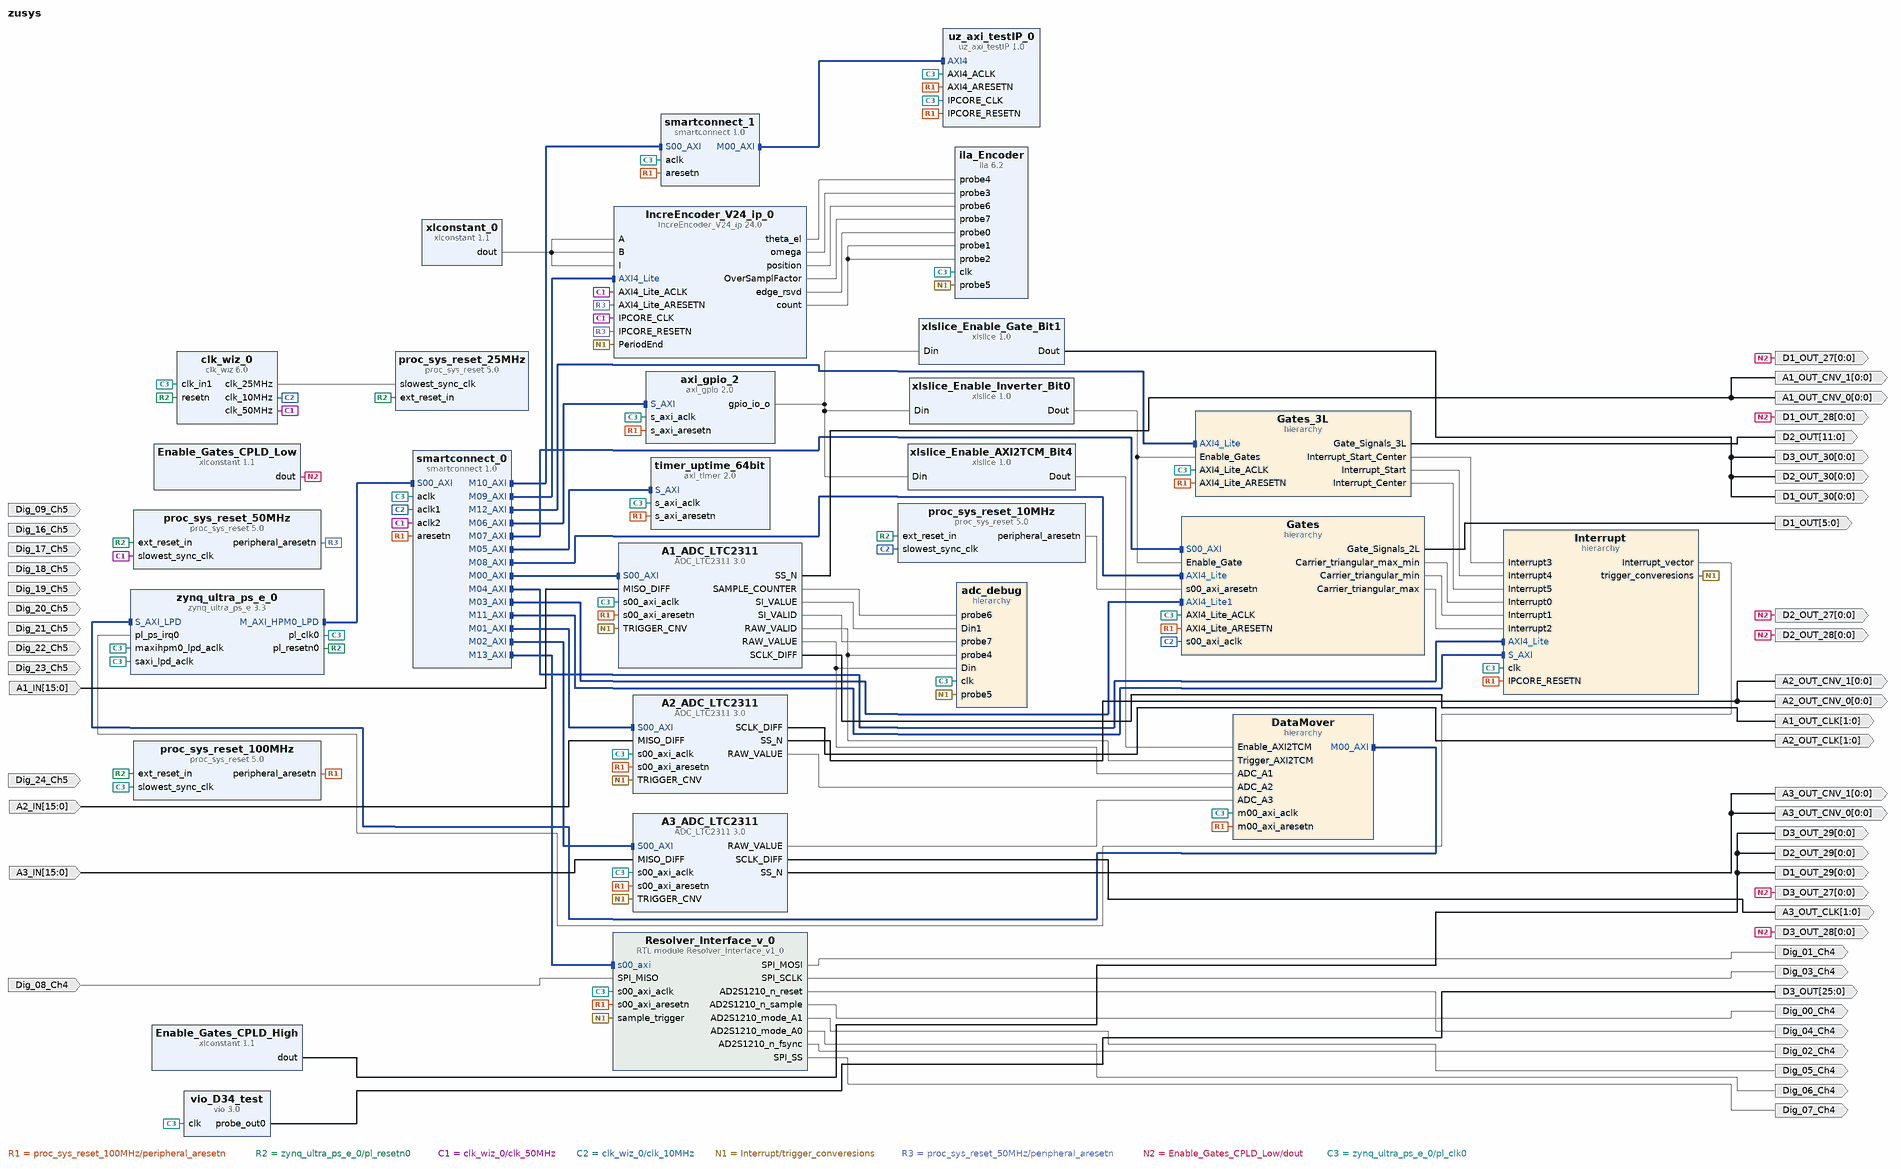
[diagram p0: block diagram of the top level]
# Vivado block design zusys, xczu9eg-ffvc900-1-e, Vivado 2020.1.1
create_bd_design zusys

create_bd_port -dir I Dig_16_Ch5
create_bd_port -dir I Dig_18_Ch5
create_bd_port -dir I Dig_20_Ch5
create_bd_port -dir I Dig_21_Ch5
create_bd_port -dir I Dig_22_Ch5
create_bd_port -dir I Dig_23_Ch5
create_bd_port -dir I Dig_24_Ch5
create_bd_port -dir I Dig_17_Ch5
create_bd_port -dir I Dig_19_Ch5
create_bd_port -dir O -from 0 -to 0 D1_OUT_29
create_bd_port -dir O -from 0 -to 0 D1_OUT_28
create_bd_port -dir O -from 0 -to 0 D1_OUT_27
create_bd_port -dir O -from 0 -to 0 D1_OUT_30
create_bd_port -dir O -from 0 -to 0 D2_OUT_28
create_bd_port -dir O -from 0 -to 0 D2_OUT_27
create_bd_port -dir O -from 0 -to 0 D2_OUT_29
create_bd_port -dir O -from 0 -to 0 D2_OUT_30
create_bd_port -dir O -from 11 -to 0 D2_OUT
create_bd_port -dir I -from 15 -to 0 A2_IN
create_bd_port -dir I -from 15 -to 0 A3_IN
create_bd_port -dir I -from 15 -to 0 A1_IN
create_bd_port -dir O -from 0 -to 0 D3_OUT_28
create_bd_port -dir O -from 0 -to 0 D3_OUT_29
create_bd_port -dir O -from 0 -to 0 D3_OUT_30
create_bd_port -dir O -from 25 -to 0 D3_OUT
create_bd_port -dir O -from 0 -to 0 D3_OUT_27
create_bd_port -dir O -from 5 -to 0 D1_OUT
create_bd_port -dir O -from 1 -to 0 A3_OUT_CLK
create_bd_port -dir O -from 1 -to 0 A2_OUT_CLK
create_bd_port -dir O -from 0 -to 0 A2_OUT_CNV_0
create_bd_port -dir O -from 0 -to 0 A2_OUT_CNV_1
create_bd_port -dir O -from 0 -to 0 A3_OUT_CNV_0
create_bd_port -dir O -from 0 -to 0 A3_OUT_CNV_1
create_bd_port -dir O -from 0 -to 0 A1_OUT_CNV_1
create_bd_port -dir O -from 0 -to 0 A1_OUT_CNV_0
create_bd_port -dir O -from 1 -to 0 A1_OUT_CLK
create_bd_port -dir I Dig_09_Ch5
create_bd_port -dir O Dig_00_Ch4
create_bd_port -dir O Dig_02_Ch4
create_bd_port -dir O Dig_03_Ch4
create_bd_port -dir O Dig_04_Ch4
create_bd_port -dir O Dig_05_Ch4
create_bd_port -dir O Dig_06_Ch4
create_bd_port -dir O Dig_07_Ch4
create_bd_port -dir O Dig_01_Ch4
create_bd_port -dir I Dig_08_Ch4

create_bd_cell -type ip -vlnv xilinx.com:ip:proc_sys_reset:5.0 proc_sys_reset_25MHz
create_bd_cell -type ip -vlnv xilinx.com:ip:proc_sys_reset:5.0 proc_sys_reset_10MHz
create_bd_cell -type ip -vlnv xilinx.com:ip:proc_sys_reset:5.0 proc_sys_reset_50MHz
create_bd_cell -type ip -vlnv xilinx.com:ip:proc_sys_reset:5.0 proc_sys_reset_100MHz
create_bd_cell -type ip -vlnv xilinx.com:ip:xlslice:1.0 xlslice_Enable_Inverter_Bit0
set_property -dict {CONFIG.DIN_FROM 0 CONFIG.DIN_TO 0 CONFIG.DIN_WIDTH 8} [get_bd_cells xlslice_Enable_Inverter_Bit0]
create_bd_cell -type ip -vlnv xilinx.com:ip:xlslice:1.0 xlslice_Enable_Gate_Bit1
set_property -dict [list \
  CONFIG.DIN_FROM 1 \
  CONFIG.DIN_TO 1 \
  CONFIG.DIN_WIDTH 8 \
  CONFIG.DOUT_WIDTH 1 \
] [get_bd_cells xlslice_Enable_Gate_Bit1]
create_bd_cell -type hier Gates
create_bd_cell -type hier DataMover
create_bd_cell -type ip -vlnv xilinx.com:ip:xlslice:1.0 xlslice_Enable_AXI2TCM_Bit4
set_property -dict [list \
  CONFIG.DIN_FROM 4 \
  CONFIG.DIN_TO 4 \
  CONFIG.DIN_WIDTH 8 \
  CONFIG.DOUT_WIDTH 1 \
] [get_bd_cells xlslice_Enable_AXI2TCM_Bit4]
create_bd_cell -type ip -vlnv xilinx.com:ip:vio:3.0 vio_D34_test
set_property -dict {CONFIG.C_NUM_PROBE_IN 0 CONFIG.C_NUM_PROBE_OUT 1 CONFIG.C_PROBE_OUT0_WIDTH 26} [get_bd_cells vio_D34_test]
create_bd_cell -type ip -vlnv xilinx.com:ip:xlconstant:1.1 Enable_Gates_CPLD_High
create_bd_cell -type ip -vlnv xilinx.com:ip:xlconstant:1.1 Enable_Gates_CPLD_Low
set_property -dict {CONFIG.CONST_VAL 0} [get_bd_cells Enable_Gates_CPLD_Low]
create_bd_cell -type ip -vlnv xilinx.com:ip:axi_gpio:2.0 axi_gpio_2
set_property -dict {CONFIG.C_GPIO_WIDTH 8} [get_bd_cells axi_gpio_2]
create_bd_cell -type ip -vlnv xilinx.com:ip:clk_wiz:6.0 clk_wiz_0
set_property -dict [list \
  CONFIG.AUTO_PRIMITIVE PLL \
  CONFIG.CLKOUT1_DRIVES Buffer \
  CONFIG.CLKOUT1_JITTER 167.017 \
  CONFIG.CLKOUT1_PHASE_ERROR 114.212 \
  CONFIG.CLKOUT1_REQUESTED_OUT_FREQ 50.000 \
  CONFIG.CLKOUT2_DRIVES Buffer \
  CONFIG.CLKOUT2_JITTER 229.362 \
  CONFIG.CLKOUT2_PHASE_ERROR 114.212 \
  CONFIG.CLKOUT2_REQUESTED_OUT_FREQ 10.000 \
  CONFIG.CLKOUT2_USED true \
  CONFIG.CLKOUT3_DRIVES Buffer \
  CONFIG.CLKOUT3_JITTER 191.696 \
  CONFIG.CLKOUT3_PHASE_ERROR 114.212 \
  CONFIG.CLKOUT3_REQUESTED_OUT_FREQ 25.000 \
  CONFIG.CLKOUT3_USED true \
  CONFIG.CLKOUT4_DRIVES Buffer \
  CONFIG.CLKOUT5_DRIVES Buffer \
  CONFIG.CLKOUT6_DRIVES Buffer \
  CONFIG.CLKOUT7_DRIVES Buffer \
  CONFIG.CLK_OUT1_PORT clk_50MHz \
  CONFIG.CLK_OUT2_PORT clk_10MHz \
  CONFIG.CLK_OUT3_PORT clk_25MHz \
  CONFIG.FEEDBACK_SOURCE FDBK_AUTO \
  CONFIG.MMCM_CLKFBOUT_MULT_F 8 \
  CONFIG.MMCM_CLKIN1_PERIOD 10.000 \
  CONFIG.MMCM_CLKIN2_PERIOD 10.000 \
  CONFIG.MMCM_CLKOUT0_DIVIDE_F 16 \
  CONFIG.MMCM_CLKOUT1_DIVIDE 80 \
  CONFIG.MMCM_CLKOUT2_DIVIDE 32 \
  CONFIG.MMCM_COMPENSATION AUTO \
  CONFIG.MMCM_DIVCLK_DIVIDE 1 \
  CONFIG.NUM_OUT_CLKS 3 \
  CONFIG.OVERRIDE_MMCM false \
  CONFIG.PRIMITIVE Auto \
  CONFIG.PRIM_SOURCE Single_ended_clock_capable_pin \
  CONFIG.RESET_PORT resetn \
  CONFIG.RESET_TYPE ACTIVE_LOW \
  CONFIG.SECONDARY_SOURCE Single_ended_clock_capable_pin \
  CONFIG.USE_LOCKED false \
  CONFIG.USE_PHASE_ALIGNMENT false \
  CONFIG.USE_RESET true \
] [get_bd_cells clk_wiz_0]
create_bd_cell -type ip -vlnv xilinx.com:ip:ila:6.2 ila_Encoder
set_property -dict [list \
  CONFIG.C_DATA_DEPTH 2048 \
  CONFIG.C_ENABLE_ILA_AXI_MON false \
  CONFIG.C_MONITOR_TYPE Native \
  CONFIG.C_NUM_OF_PROBES 8 \
  CONFIG.C_PROBE3_WIDTH 24 \
  CONFIG.C_PROBE4_WIDTH 24 \
] [get_bd_cells ila_Encoder]
create_bd_cell -type ip -vlnv xilinx.com:ip:smartconnect:1.0 smartconnect_0
set_property -dict {CONFIG.NUM_CLKS 3 CONFIG.NUM_MI 14 CONFIG.NUM_SI 1} [get_bd_cells smartconnect_0]
create_bd_cell -type ip -vlnv xilinx.com:ip:zynq_ultra_ps_e:3.3 zynq_ultra_ps_e_0
set_property -dict [list \
  CONFIG.CAN0_BOARD_INTERFACE custom \
  CONFIG.CAN1_BOARD_INTERFACE custom \
  CONFIG.CSU_BOARD_INTERFACE custom \
  CONFIG.DP_BOARD_INTERFACE custom \
  CONFIG.GEM0_BOARD_INTERFACE custom \
  CONFIG.GEM1_BOARD_INTERFACE custom \
  CONFIG.GEM2_BOARD_INTERFACE custom \
  CONFIG.GEM3_BOARD_INTERFACE custom \
  CONFIG.GPIO_BOARD_INTERFACE custom \
  CONFIG.IIC0_BOARD_INTERFACE custom \
  CONFIG.IIC1_BOARD_INTERFACE custom \
  CONFIG.NAND_BOARD_INTERFACE custom \
  CONFIG.PCIE_BOARD_INTERFACE custom \
  CONFIG.PJTAG_BOARD_INTERFACE custom \
  CONFIG.PMU_BOARD_INTERFACE custom \
  CONFIG.PSU_BANK_0_IO_STANDARD LVCMOS18 \
  CONFIG.PSU_BANK_1_IO_STANDARD LVCMOS18 \
  CONFIG.PSU_BANK_2_IO_STANDARD LVCMOS18 \
  CONFIG.PSU_BANK_3_IO_STANDARD LVCMOS18 \
  CONFIG.PSU_USB3__DUAL_CLOCK_ENABLE 0 \
  CONFIG.PSU__CAN0__PERIPHERAL__ENABLE 1 \
  CONFIG.PSU__CAN0__PERIPHERAL__IO {MIO 22 .. 23} \
  CONFIG.PSU__CAN1__PERIPHERAL__ENABLE 1 \
  CONFIG.PSU__CAN1__PERIPHERAL__IO {MIO 24 .. 25} \
  CONFIG.PSU__CRF_APB__ACPU_CTRL__FREQMHZ 1200 \
  CONFIG.PSU__CRF_APB__ACPU_CTRL__SRCSEL APLL \
  CONFIG.PSU__CRF_APB__APLL_CTRL__SRCSEL PSS_REF_CLK \
  CONFIG.PSU__CRF_APB__DBG_FPD_CTRL__FREQMHZ 250 \
  CONFIG.PSU__CRF_APB__DBG_FPD_CTRL__SRCSEL IOPLL \
  CONFIG.PSU__CRF_APB__DBG_TRACE_CTRL__FREQMHZ 250 \
  CONFIG.PSU__CRF_APB__DBG_TRACE_CTRL__SRCSEL IOPLL \
  CONFIG.PSU__CRF_APB__DBG_TSTMP_CTRL__FREQMHZ 250 \
  CONFIG.PSU__CRF_APB__DBG_TSTMP_CTRL__SRCSEL IOPLL \
  CONFIG.PSU__CRF_APB__DDR_CTRL__FREQMHZ 1200 \
  CONFIG.PSU__CRF_APB__DDR_CTRL__SRCSEL DPLL \
  CONFIG.PSU__CRF_APB__DPDMA_REF_CTRL__FREQMHZ 600 \
  CONFIG.PSU__CRF_APB__DPDMA_REF_CTRL__SRCSEL DPLL \
  CONFIG.PSU__CRF_APB__DPLL_CTRL__SRCSEL PSS_REF_CLK \
  CONFIG.PSU__CRF_APB__DP_AUDIO_REF_CTRL__SRCSEL VPLL \
  CONFIG.PSU__CRF_APB__DP_STC_REF_CTRL__SRCSEL VPLL \
  CONFIG.PSU__CRF_APB__DP_VIDEO_REF_CTRL__SRCSEL VPLL \
  CONFIG.PSU__CRF_APB__GDMA_REF_CTRL__FREQMHZ 600 \
  CONFIG.PSU__CRF_APB__GDMA_REF_CTRL__SRCSEL DPLL \
  CONFIG.PSU__CRF_APB__GPU_REF_CTRL__FREQMHZ 600 \
  CONFIG.PSU__CRF_APB__GPU_REF_CTRL__SRCSEL DPLL \
  CONFIG.PSU__CRF_APB__TOPSW_LSBUS_CTRL__FREQMHZ 100 \
  CONFIG.PSU__CRF_APB__TOPSW_LSBUS_CTRL__SRCSEL IOPLL \
  CONFIG.PSU__CRF_APB__TOPSW_MAIN_CTRL__FREQMHZ 533.333 \
  CONFIG.PSU__CRF_APB__TOPSW_MAIN_CTRL__SRCSEL APLL \
  CONFIG.PSU__CRF_APB__VPLL_CTRL__SRCSEL PSS_REF_CLK \
  CONFIG.PSU__CRL_APB__ADMA_REF_CTRL__FREQMHZ 500 \
  CONFIG.PSU__CRL_APB__ADMA_REF_CTRL__SRCSEL IOPLL \
  CONFIG.PSU__CRL_APB__CAN1_REF_CTRL__FREQMHZ 100 \
  CONFIG.PSU__CRL_APB__CAN1_REF_CTRL__SRCSEL IOPLL \
  CONFIG.PSU__CRL_APB__CPU_R5_CTRL__FREQMHZ 500 \
  CONFIG.PSU__CRL_APB__CPU_R5_CTRL__SRCSEL IOPLL \
  CONFIG.PSU__CRL_APB__DBG_LPD_CTRL__FREQMHZ 250 \
  CONFIG.PSU__CRL_APB__DBG_LPD_CTRL__SRCSEL IOPLL \
  CONFIG.PSU__CRL_APB__GEM3_REF_CTRL__FREQMHZ 125 \
  CONFIG.PSU__CRL_APB__GEM3_REF_CTRL__SRCSEL IOPLL \
  CONFIG.PSU__CRL_APB__I2C0_REF_CTRL__FREQMHZ 100 \
  CONFIG.PSU__CRL_APB__I2C0_REF_CTRL__SRCSEL IOPLL \
  CONFIG.PSU__CRL_APB__I2C1_REF_CTRL__FREQMHZ 100 \
  CONFIG.PSU__CRL_APB__I2C1_REF_CTRL__SRCSEL IOPLL \
  CONFIG.PSU__CRL_APB__IOPLL_CTRL__SRCSEL PSS_REF_CLK \
  CONFIG.PSU__CRL_APB__IOU_SWITCH_CTRL__FREQMHZ 267 \
  CONFIG.PSU__CRL_APB__IOU_SWITCH_CTRL__SRCSEL RPLL \
  CONFIG.PSU__CRL_APB__LPD_LSBUS_CTRL__FREQMHZ 100 \
  CONFIG.PSU__CRL_APB__LPD_LSBUS_CTRL__SRCSEL IOPLL \
  CONFIG.PSU__CRL_APB__LPD_SWITCH_CTRL__FREQMHZ 500 \
  CONFIG.PSU__CRL_APB__LPD_SWITCH_CTRL__SRCSEL IOPLL \
  CONFIG.PSU__CRL_APB__PCAP_CTRL__FREQMHZ 200 \
  CONFIG.PSU__CRL_APB__PCAP_CTRL__SRCSEL IOPLL \
  CONFIG.PSU__CRL_APB__PL0_REF_CTRL__FREQMHZ 100 \
  CONFIG.PSU__CRL_APB__PL0_REF_CTRL__SRCSEL RPLL \
  CONFIG.PSU__CRL_APB__QSPI_REF_CTRL__FREQMHZ 300 \
  CONFIG.PSU__CRL_APB__QSPI_REF_CTRL__SRCSEL IOPLL \
  CONFIG.PSU__CRL_APB__RPLL_CTRL__SRCSEL PSS_REF_CLK \
  CONFIG.PSU__CRL_APB__SDIO1_REF_CTRL__FREQMHZ 200 \
  CONFIG.PSU__CRL_APB__SDIO1_REF_CTRL__SRCSEL RPLL \
  CONFIG.PSU__CRL_APB__TIMESTAMP_REF_CTRL__FREQMHZ 100 \
  CONFIG.PSU__CRL_APB__TIMESTAMP_REF_CTRL__SRCSEL PSS_REF_CLK \
  CONFIG.PSU__CRL_APB__UART0_REF_CTRL__FREQMHZ 100 \
  CONFIG.PSU__CRL_APB__UART0_REF_CTRL__SRCSEL IOPLL \
  CONFIG.PSU__CRL_APB__UART1_REF_CTRL__FREQMHZ 100 \
  CONFIG.PSU__CRL_APB__UART1_REF_CTRL__SRCSEL IOPLL \
  CONFIG.PSU__CRL_APB__USB0_BUS_REF_CTRL__FREQMHZ 250 \
  CONFIG.PSU__CRL_APB__USB0_BUS_REF_CTRL__SRCSEL IOPLL \
  CONFIG.PSU__CRL_APB__USB3_DUAL_REF_CTRL__FREQMHZ 20 \
  CONFIG.PSU__CRL_APB__USB3_DUAL_REF_CTRL__SRCSEL IOPLL \
  CONFIG.PSU__CRL_APB__USB3__ENABLE 0 \
  CONFIG.PSU__CSUPMU__PERIPHERAL__VALID 0 \
  CONFIG.PSU__DDRC__BUS_WIDTH {64 Bit} \
  CONFIG.PSU__DDRC__COMPONENTS Components \
  CONFIG.PSU__DDRC__DEVICE_CAPACITY {8192 MBits} \
  CONFIG.PSU__DDRC__DRAM_WIDTH {16 Bits} \
  CONFIG.PSU__DDRC__ECC Disabled \
  CONFIG.PSU__DDRC__MEMORY_TYPE {DDR 4} \
  CONFIG.PSU__DDRC__SPEED_BIN DDR4_2400P \
  CONFIG.PSU__DDR_HIGH_ADDRESS_GUI_ENABLE 1 \
  CONFIG.PSU__DDR__INTERFACE__FREQMHZ 600.000 \
  CONFIG.PSU__DEVICE_TYPE EG \
  CONFIG.PSU__DISPLAYPORT__PERIPHERAL__ENABLE 0 \
  CONFIG.PSU__DLL__ISUSED 1 \
  CONFIG.PSU__ENET3__FIFO__ENABLE 0 \
  CONFIG.PSU__ENET3__GRP_MDIO__ENABLE 1 \
  CONFIG.PSU__ENET3__GRP_MDIO__IO {MIO 76 .. 77} \
  CONFIG.PSU__ENET3__PERIPHERAL__ENABLE 1 \
  CONFIG.PSU__ENET3__PERIPHERAL__IO {MIO 64 .. 75} \
  CONFIG.PSU__ENET3__PTP__ENABLE 0 \
  CONFIG.PSU__ENET3__TSU__ENABLE 0 \
  CONFIG.PSU__FPD_SLCR__WDT1__FREQMHZ 100 \
  CONFIG.PSU__FPGA_PL0_ENABLE 1 \
  CONFIG.PSU__GEM3_COHERENCY 0 \
  CONFIG.PSU__GEM3_ROUTE_THROUGH_FPD 0 \
  CONFIG.PSU__GEM__TSU__ENABLE 0 \
  CONFIG.PSU__GPIO0_MIO__IO {MIO 0 .. 25} \
  CONFIG.PSU__GPIO0_MIO__PERIPHERAL__ENABLE 1 \
  CONFIG.PSU__GPIO1_MIO__IO {MIO 26 .. 51} \
  CONFIG.PSU__GPIO1_MIO__PERIPHERAL__ENABLE 1 \
  CONFIG.PSU__I2C0__PERIPHERAL__ENABLE 1 \
  CONFIG.PSU__I2C0__PERIPHERAL__IO {MIO 14 .. 15} \
  CONFIG.PSU__I2C1__PERIPHERAL__ENABLE 1 \
  CONFIG.PSU__I2C1__PERIPHERAL__IO {MIO 16 .. 17} \
  CONFIG.PSU__IOU_SLCR__IOU_TTC_APB_CLK__TTC0_SEL APB \
  CONFIG.PSU__IOU_SLCR__IOU_TTC_APB_CLK__TTC1_SEL APB \
  CONFIG.PSU__IOU_SLCR__IOU_TTC_APB_CLK__TTC2_SEL APB \
  CONFIG.PSU__IOU_SLCR__IOU_TTC_APB_CLK__TTC3_SEL APB \
  CONFIG.PSU__IOU_SLCR__TTC1__FREQMHZ 100 \
  CONFIG.PSU__IOU_SLCR__TTC2__FREQMHZ 100 \
  CONFIG.PSU__IOU_SLCR__WDT0__FREQMHZ 100 \
  CONFIG.PSU__LPD_SLCR__CSUPMU__FREQMHZ 100 \
  CONFIG.PSU__MAXIGP2__DATA_WIDTH 128 \
  CONFIG.PSU__OVERRIDE_HPX_QOS 0 \
  CONFIG.PSU__OVERRIDE__BASIC_CLOCK 0 \
  CONFIG.PSU__PCIE__CLASS_CODE_BASE 0x06 \
  CONFIG.PSU__PCIE__CLASS_CODE_INTERFACE 0x0 \
  CONFIG.PSU__PCIE__CLASS_CODE_SUB 0x04 \
  CONFIG.PSU__PCIE__DEVICE_ID 0xD021 \
  CONFIG.PSU__PCIE__REVISION_ID 0x0 \
  CONFIG.PSU__PCIE__SUBSYSTEM_ID 0x7 \
  CONFIG.PSU__PCIE__SUBSYSTEM_VENDOR_ID 0x10EE \
  CONFIG.PSU__PCIE__VENDOR_ID 0x10EE \
  CONFIG.PSU__PJTAG__PERIPHERAL__ENABLE 1 \
  CONFIG.PSU__PJTAG__PERIPHERAL__IO {MIO 26 .. 29} \
  CONFIG.PSU__PMU__PERIPHERAL__ENABLE 0 \
  CONFIG.PSU__PRESET_APPLIED 0 \
  CONFIG.PSU__PSS_REF_CLK__FREQMHZ 33.333333 \
  CONFIG.PSU__QSPI_COHERENCY 0 \
  CONFIG.PSU__QSPI_ROUTE_THROUGH_FPD 0 \
  CONFIG.PSU__QSPI__GRP_FBCLK__ENABLE 1 \
  CONFIG.PSU__QSPI__GRP_FBCLK__IO {MIO 6} \
  CONFIG.PSU__QSPI__PERIPHERAL__DATA_MODE x4 \
  CONFIG.PSU__QSPI__PERIPHERAL__ENABLE 1 \
  CONFIG.PSU__QSPI__PERIPHERAL__IO {MIO 0 .. 12} \
  CONFIG.PSU__QSPI__PERIPHERAL__MODE {Dual Parallel} \
  CONFIG.PSU__SATA__PERIPHERAL__ENABLE 0 \
  CONFIG.PSU__SAXIGP6__DATA_WIDTH 32 \
  CONFIG.PSU__SD0__RESET__ENABLE 1 \
  CONFIG.PSU__SD1_COHERENCY 0 \
  CONFIG.PSU__SD1_ROUTE_THROUGH_FPD 0 \
  CONFIG.PSU__SD1__DATA_TRANSFER_MODE 4Bit \
  CONFIG.PSU__SD1__GRP_CD__ENABLE 0 \
  CONFIG.PSU__SD1__GRP_POW__ENABLE 0 \
  CONFIG.PSU__SD1__GRP_WP__ENABLE 0 \
  CONFIG.PSU__SD1__PERIPHERAL__ENABLE 1 \
  CONFIG.PSU__SD1__PERIPHERAL__IO {MIO 46 .. 51} \
  CONFIG.PSU__SD1__SLOT_TYPE {SD 2.0} \
  CONFIG.PSU__SPI0__GRP_SS0__IO {MIO 41} \
  CONFIG.PSU__SPI0__PERIPHERAL__ENABLE 1 \
  CONFIG.PSU__SPI0__PERIPHERAL__IO {MIO 38 .. 43} \
  CONFIG.PSU__SPI1__GRP_SS0__IO {MIO 35} \
  CONFIG.PSU__SPI1__PERIPHERAL__ENABLE 1 \
  CONFIG.PSU__SPI1__PERIPHERAL__IO {MIO 32 .. 37} \
  CONFIG.PSU__SWDT0__PERIPHERAL__ENABLE 0 \
  CONFIG.PSU__SWDT1__PERIPHERAL__ENABLE 0 \
  CONFIG.PSU__TSU__BUFG_PORT_PAIR 0 \
  CONFIG.PSU__TTC0__CLOCK__ENABLE 0 \
  CONFIG.PSU__TTC0__PERIPHERAL__ENABLE 1 \
  CONFIG.PSU__TTC0__WAVEOUT__ENABLE 0 \
  CONFIG.PSU__TTC1__PERIPHERAL__ENABLE 0 \
  CONFIG.PSU__TTC2__PERIPHERAL__ENABLE 0 \
  CONFIG.PSU__TTC3__CLOCK__ENABLE 0 \
  CONFIG.PSU__TTC3__PERIPHERAL__ENABLE 1 \
  CONFIG.PSU__TTC3__WAVEOUT__ENABLE 0 \
  CONFIG.PSU__UART0__BAUD_RATE 115200 \
  CONFIG.PSU__UART0__MODEM__ENABLE 0 \
  CONFIG.PSU__UART0__PERIPHERAL__ENABLE 1 \
  CONFIG.PSU__UART0__PERIPHERAL__IO {MIO 18 .. 19} \
  CONFIG.PSU__UART1__BAUD_RATE 115200 \
  CONFIG.PSU__UART1__MODEM__ENABLE 0 \
  CONFIG.PSU__UART1__PERIPHERAL__ENABLE 1 \
  CONFIG.PSU__UART1__PERIPHERAL__IO {MIO 20 .. 21} \
  CONFIG.PSU__USB0__PERIPHERAL__ENABLE 0 \
  CONFIG.PSU__USE__IRQ0 1 \
  CONFIG.PSU__USE__M_AXI_GP0 0 \
  CONFIG.PSU__USE__M_AXI_GP1 0 \
  CONFIG.PSU__USE__M_AXI_GP2 1 \
  CONFIG.PSU__USE__S_AXI_GP6 1 \
  CONFIG.QSPI_BOARD_INTERFACE custom \
  CONFIG.SATA_BOARD_INTERFACE custom \
  CONFIG.SD0_BOARD_INTERFACE custom \
  CONFIG.SD1_BOARD_INTERFACE custom \
  CONFIG.SPI0_BOARD_INTERFACE custom \
  CONFIG.SPI1_BOARD_INTERFACE custom \
  CONFIG.SUBPRESET1 Custom \
  CONFIG.SUBPRESET2 Custom \
  CONFIG.SWDT0_BOARD_INTERFACE custom \
  CONFIG.SWDT1_BOARD_INTERFACE custom \
  CONFIG.TRACE_BOARD_INTERFACE custom \
  CONFIG.TTC0_BOARD_INTERFACE custom \
  CONFIG.TTC1_BOARD_INTERFACE custom \
  CONFIG.TTC2_BOARD_INTERFACE custom \
  CONFIG.TTC3_BOARD_INTERFACE custom \
  CONFIG.UART0_BOARD_INTERFACE custom \
  CONFIG.UART1_BOARD_INTERFACE custom \
  CONFIG.USB0_BOARD_INTERFACE custom \
  CONFIG.USB1_BOARD_INTERFACE custom \
] [get_bd_cells zynq_ultra_ps_e_0]
# 742 more settings of zynq_ultra_ps_e_0 are not shown: defaults, MIO pin electricals, DDR timing, and values the tool derives
create_bd_cell -type hier Gates_3L
create_bd_cell -type ip -vlnv xilinx.com:ip:IncreEncoder_V24_ip:24.0 IncreEncoder_V24_ip_0
create_bd_cell -type hier Interrupt
create_bd_cell -type ip -vlnv xilinx.com:ip:axi_timer:2.0 timer_uptime_64bit
set_property -dict {CONFIG.mode_64bit 1} [get_bd_cells timer_uptime_64bit]
create_bd_cell -type ip -vlnv user.org:ip:uz_axi_testIP:1.0 uz_axi_testIP_0
create_bd_cell -type hier adc_debug
create_bd_cell -type ip -vlnv UltraZohm:user:ADC_LTC2311:3.0 A1_ADC_LTC2311
set_property -dict {CONFIG.RES_LSB 0 CONFIG.RES_MSB 34 CONFIG.SPI_MASTER 1} [get_bd_cells A1_ADC_LTC2311]
create_bd_cell -type ip -vlnv UltraZohm:user:ADC_LTC2311:3.0 A2_ADC_LTC2311
set_property -dict {CONFIG.RES_LSB 0 CONFIG.RES_MSB 34} [get_bd_cells A2_ADC_LTC2311]
create_bd_cell -type ip -vlnv UltraZohm:user:ADC_LTC2311:3.0 A3_ADC_LTC2311
set_property -dict {CONFIG.RES_LSB 0 CONFIG.RES_MSB 34} [get_bd_cells A3_ADC_LTC2311]
create_bd_cell -type ip -vlnv xilinx.com:ip:smartconnect:1.0 smartconnect_1
set_property -dict {CONFIG.NUM_MI 1 CONFIG.NUM_SI 1} [get_bd_cells smartconnect_1]
create_bd_cell -type module -reference Resolver_Interface_v1_0 Resolver_Interface_v_0
create_bd_cell -type ip -vlnv xilinx.com:ip:xlconstant:1.1 xlconstant_0
set_property -dict {CONFIG.CONST_VAL 0} [get_bd_cells xlconstant_0]

# ---- hierarchy /Gates ----
current_bd_instance /Gates
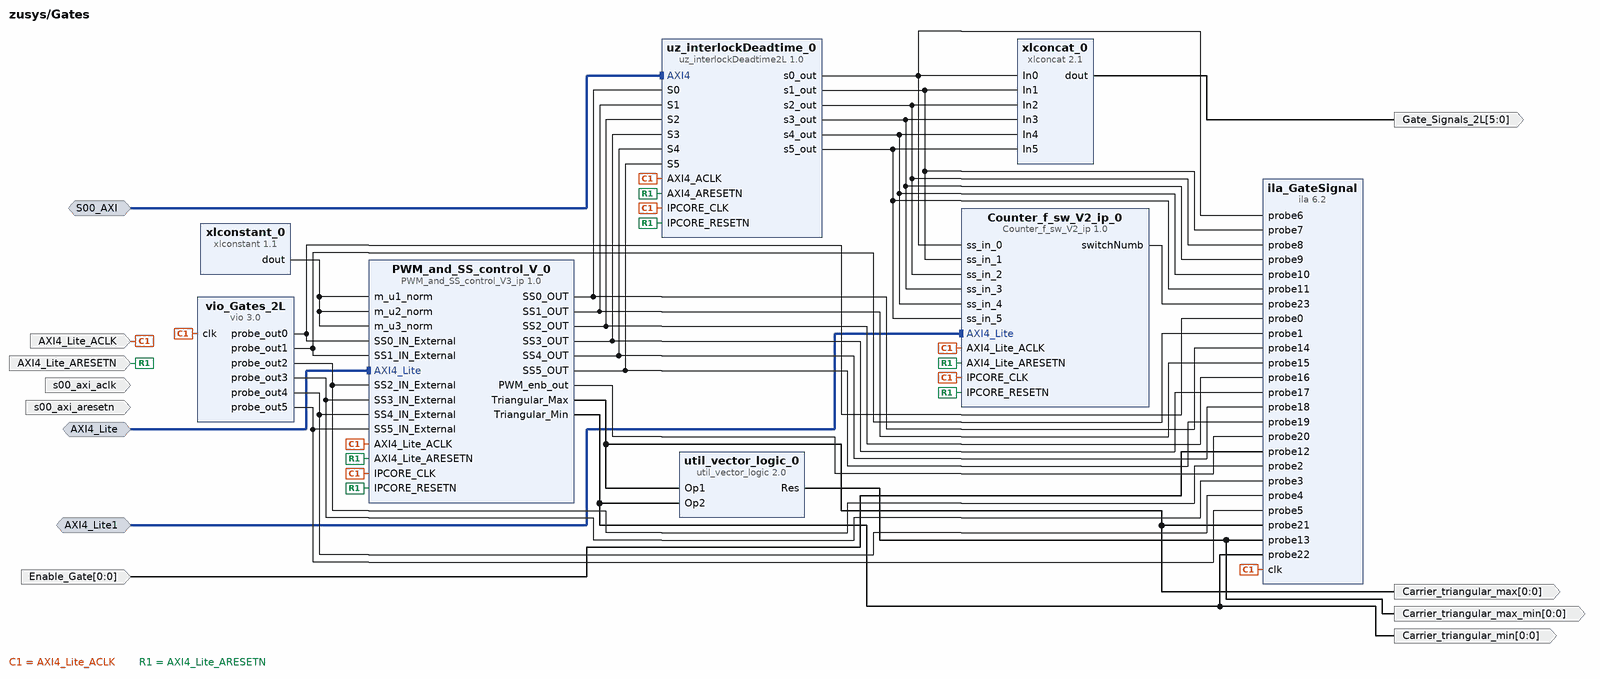
[diagram p1: block diagram inside /Gates]
create_bd_intf_pin -mode Slave -vlnv xilinx.com:interface:aximm_rtl:1.0 S00_AXI
create_bd_intf_pin -mode Slave -vlnv xilinx.com:interface:aximm_rtl:1.0 AXI4_Lite
create_bd_intf_pin -mode Slave -vlnv xilinx.com:interface:aximm_rtl:1.0 AXI4_Lite1
create_bd_pin -dir I -type clk s00_axi_aclk
create_bd_pin -dir I -type rst s00_axi_aresetn
create_bd_pin -dir I -from 0 -to 0 Enable_Gate
create_bd_pin -dir I -type clk AXI4_Lite_ACLK
create_bd_pin -dir I -type rst AXI4_Lite_ARESETN
create_bd_pin -dir O -from 0 -to 0 Carrier_triangular_max_min
create_bd_pin -dir O -from 5 -to 0 Gate_Signals_2L
create_bd_pin -dir O -from 0 -to 0 Carrier_triangular_min
create_bd_pin -dir O -from 0 -to 0 Carrier_triangular_max

create_bd_cell -type ip -vlnv xilinx.com:ip:PWM_and_SS_control_V3_ip:1.0 PWM_and_SS_control_V_0
create_bd_cell -type ip -vlnv xilinx.com:ip:ila:6.2 ila_GateSignal
set_property -dict [list \
  CONFIG.C_DATA_DEPTH 4096 \
  CONFIG.C_ENABLE_ILA_AXI_MON false \
  CONFIG.C_MONITOR_TYPE Native \
  CONFIG.C_NUM_OF_PROBES 24 \
  CONFIG.C_PROBE0_WIDTH 1 \
  CONFIG.C_PROBE14_WIDTH 1 \
  CONFIG.C_PROBE15_WIDTH 1 \
  CONFIG.C_PROBE16_WIDTH 1 \
  CONFIG.C_PROBE17_WIDTH 1 \
  CONFIG.C_PROBE1_WIDTH 1 \
  CONFIG.C_PROBE2_WIDTH 1 \
  CONFIG.C_PROBE3_WIDTH 1 \
] [get_bd_cells ila_GateSignal]
create_bd_cell -type ip -vlnv xilinx.com:ip:xlconstant:1.1 xlconstant_0
set_property -dict {CONFIG.CONST_VAL 2048 CONFIG.CONST_WIDTH 14} [get_bd_cells xlconstant_0]
create_bd_cell -type ip -vlnv xilinx.com:ip:util_vector_logic:2.0 util_vector_logic_0
set_property -dict {CONFIG.C_OPERATION or CONFIG.C_SIZE 1} [get_bd_cells util_vector_logic_0]
create_bd_cell -type ip -vlnv xilinx.com:ip:Counter_f_sw_V2_ip:1.0 Counter_f_sw_V2_ip_0
create_bd_cell -type ip -vlnv xilinx.com:ip:xlconcat:2.1 xlconcat_0
set_property -dict {CONFIG.NUM_PORTS 6} [get_bd_cells xlconcat_0]
create_bd_cell -type ip -vlnv xilinx.com:ip:vio:3.0 vio_Gates_2L
set_property -dict {CONFIG.C_NUM_PROBE_IN 0 CONFIG.C_NUM_PROBE_OUT 6} [get_bd_cells vio_Gates_2L]
create_bd_cell -type ip -vlnv user.org:ip:uz_interlockDeadtime2L:1.0 uz_interlockDeadtime_0

# ---- hierarchy /DataMover ----
current_bd_instance /DataMover
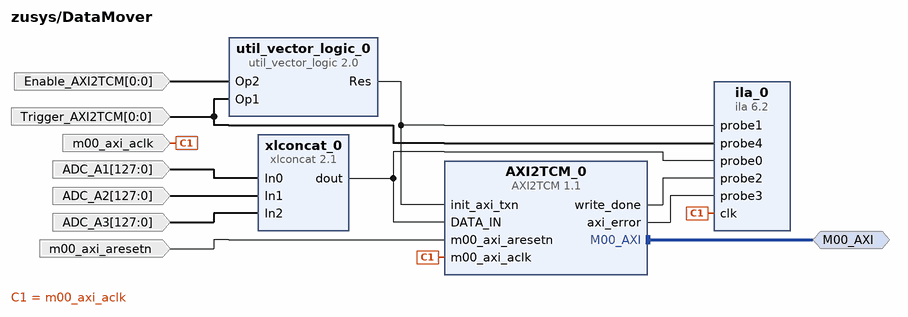
[diagram p2: block diagram inside /DataMover]
create_bd_intf_pin -mode Master -vlnv xilinx.com:interface:aximm_rtl:1.0 M00_AXI
create_bd_pin -dir I -from 127 -to 0 ADC_A1
create_bd_pin -dir I -type clk m00_axi_aclk
create_bd_pin -dir I -type rst m00_axi_aresetn
create_bd_pin -dir I -from 0 -to 0 Trigger_AXI2TCM
create_bd_pin -dir I -from 0 -to 0 Enable_AXI2TCM
create_bd_pin -dir I -from 127 -to 0 ADC_A2
create_bd_pin -dir I -from 127 -to 0 ADC_A3

create_bd_cell -type ip -vlnv xilinx.com:ip:util_vector_logic:2.0 util_vector_logic_0
set_property -dict {CONFIG.C_SIZE 1} [get_bd_cells util_vector_logic_0]
create_bd_cell -type ip -vlnv TUM:user:AXI2TCM:1.1 AXI2TCM_0
set_property -dict {CONFIG.C_M00_NUMBER_of_ADCs 24} [get_bd_cells AXI2TCM_0]
create_bd_cell -type ip -vlnv xilinx.com:ip:xlconcat:2.1 xlconcat_0
set_property -dict {CONFIG.NUM_PORTS 3} [get_bd_cells xlconcat_0]
create_bd_cell -type ip -vlnv xilinx.com:ip:ila:6.2 ila_0
set_property -dict {CONFIG.C_ENABLE_ILA_AXI_MON false CONFIG.C_MONITOR_TYPE Native CONFIG.C_NUM_OF_PROBES 5} [get_bd_cells ila_0]

# ---- hierarchy /Gates_3L ----
current_bd_instance /Gates_3L
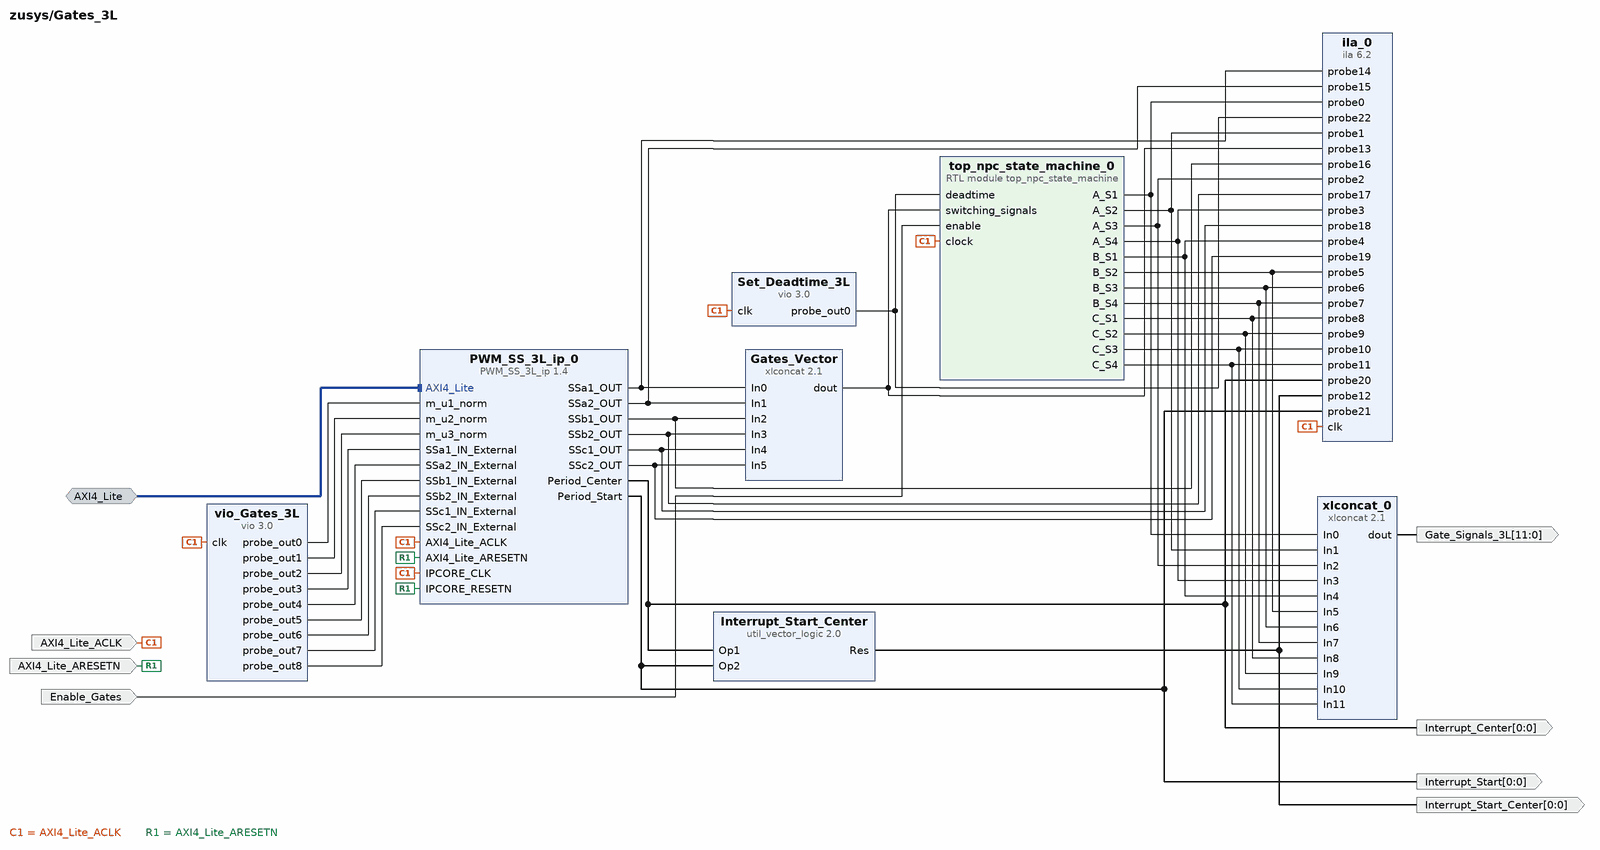
[diagram p3: block diagram inside /Gates_3L]
create_bd_intf_pin -mode Slave -vlnv xilinx.com:interface:aximm_rtl:1.0 AXI4_Lite
create_bd_pin -dir I -type clk AXI4_Lite_ACLK
create_bd_pin -dir I -type rst AXI4_Lite_ARESETN
create_bd_pin -dir O -from 11 -to 0 Gate_Signals_3L
create_bd_pin -dir I -type rst Enable_Gates
create_bd_pin -dir O -from 0 -to 0 Interrupt_Start_Center
create_bd_pin -dir O -from 0 -to 0 Interrupt_Start
create_bd_pin -dir O -from 0 -to 0 Interrupt_Center

create_bd_cell -type ip -vlnv mwn.de:ip:PWM_SS_3L_ip:1.4 PWM_SS_3L_ip_0
create_bd_cell -type module -reference top_npc_state_machine top_npc_state_machine_0
create_bd_cell -type ip -vlnv xilinx.com:ip:xlconcat:2.1 Gates_Vector
set_property -dict {CONFIG.NUM_PORTS 6} [get_bd_cells Gates_Vector]
create_bd_cell -type ip -vlnv xilinx.com:ip:xlconcat:2.1 xlconcat_0
set_property -dict {CONFIG.NUM_PORTS 12} [get_bd_cells xlconcat_0]
create_bd_cell -type ip -vlnv xilinx.com:ip:util_vector_logic:2.0 Interrupt_Start_Center
set_property -dict {CONFIG.C_OPERATION or CONFIG.C_SIZE 1} [get_bd_cells Interrupt_Start_Center]
create_bd_cell -type ip -vlnv xilinx.com:ip:ila:6.2 ila_0
set_property -dict [list \
  CONFIG.C_DATA_DEPTH 8192 \
  CONFIG.C_ENABLE_ILA_AXI_MON false \
  CONFIG.C_MONITOR_TYPE Native \
  CONFIG.C_NUM_OF_PROBES 23 \
] [get_bd_cells ila_0]
create_bd_cell -type ip -vlnv xilinx.com:ip:vio:3.0 Set_Deadtime_3L
set_property -dict [list \
  CONFIG.C_NUM_PROBE_IN 0 \
  CONFIG.C_PROBE_OUT0_INIT_VAL 0x0C8 \
  CONFIG.C_PROBE_OUT0_WIDTH 10 \
] [get_bd_cells Set_Deadtime_3L]
create_bd_cell -type ip -vlnv xilinx.com:ip:vio:3.0 vio_Gates_3L
set_property -dict [list \
  CONFIG.C_NUM_PROBE_IN 0 \
  CONFIG.C_NUM_PROBE_OUT 9 \
  CONFIG.C_PROBE_OUT0_WIDTH 14 \
  CONFIG.C_PROBE_OUT1_WIDTH 14 \
  CONFIG.C_PROBE_OUT2_WIDTH 14 \
  CONFIG.C_PROBE_OUT6_WIDTH 1 \
  CONFIG.C_PROBE_OUT7_WIDTH 1 \
  CONFIG.C_PROBE_OUT8_WIDTH 1 \
] [get_bd_cells vio_Gates_3L]

# ---- hierarchy /Interrupt ----
current_bd_instance /Interrupt
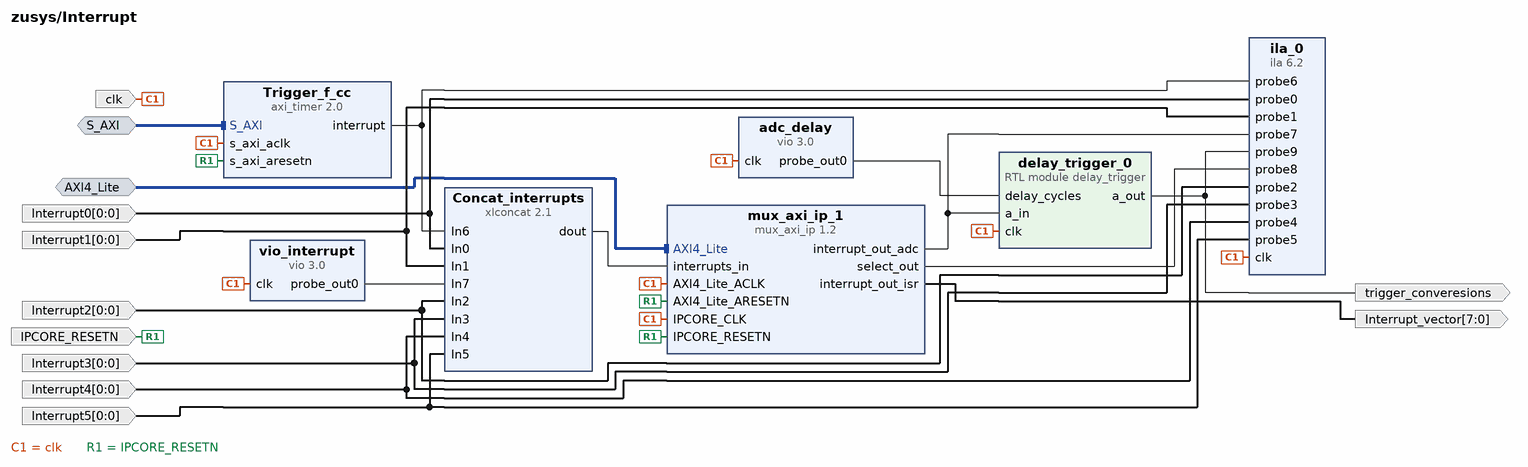
[diagram p4: block diagram inside /Interrupt]
create_bd_intf_pin -mode Slave -vlnv xilinx.com:interface:aximm_rtl:1.0 S_AXI
create_bd_intf_pin -mode Slave -vlnv xilinx.com:interface:aximm_rtl:1.0 AXI4_Lite
create_bd_pin -dir I -from 0 -to 0 Interrupt0
create_bd_pin -dir I -from 0 -to 0 Interrupt1
create_bd_pin -dir I -from 0 -to 0 Interrupt2
create_bd_pin -dir I -from 0 -to 0 Interrupt3
create_bd_pin -dir I -from 0 -to 0 Interrupt4
create_bd_pin -dir I -from 0 -to 0 Interrupt5
create_bd_pin -dir O -from 7 -to 0 Interrupt_vector
create_bd_pin -dir I -type clk clk
create_bd_pin -dir I -type rst IPCORE_RESETN
create_bd_pin -dir O trigger_converesions

create_bd_cell -type ip -vlnv xilinx.com:ip:xlconcat:2.1 Concat_interrupts
set_property -dict {CONFIG.NUM_PORTS 8 CONFIG.dout_width 8} [get_bd_cells Concat_interrupts]
create_bd_cell -type ip -vlnv xilinx.com:ip:axi_timer:2.0 Trigger_f_cc
set_property -dict {CONFIG.enable_timer2 0} [get_bd_cells Trigger_f_cc]
create_bd_cell -type ip -vlnv xilinx.com:ip:ila:6.2 ila_0
set_property -dict [list \
  CONFIG.C_DATA_DEPTH 16384 \
  CONFIG.C_ENABLE_ILA_AXI_MON false \
  CONFIG.C_MONITOR_TYPE Native \
  CONFIG.C_NUM_OF_PROBES 10 \
] [get_bd_cells ila_0]
create_bd_cell -type ip -vlnv xilinx.com:ip:vio:3.0 adc_delay
set_property -dict {CONFIG.C_NUM_PROBE_IN 0 CONFIG.C_PROBE_OUT0_WIDTH 11} [get_bd_cells adc_delay]
create_bd_cell -type module -reference delay_trigger delay_trigger_0
create_bd_cell -type ip -vlnv xilinx.com:ip:vio:3.0 vio_interrupt
set_property -dict {CONFIG.C_NUM_PROBE_IN 0} [get_bd_cells vio_interrupt]
create_bd_cell -type ip -vlnv xilinx.com:ip:mux_axi_ip:1.2 mux_axi_ip_1

# ---- hierarchy /adc_debug ----
current_bd_instance /adc_debug
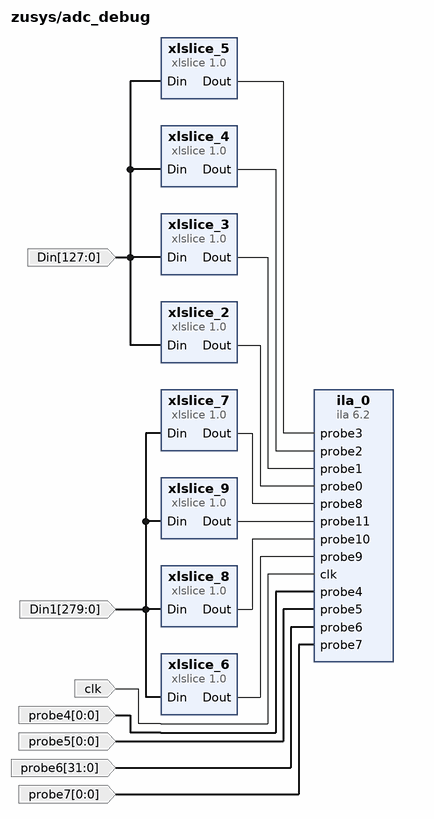
[diagram p5: block diagram inside /adc_debug]
create_bd_pin -dir I -from 127 -to 0 Din
create_bd_pin -dir I -type clk clk
create_bd_pin -dir I -from 0 -to 0 probe4
create_bd_pin -dir I -from 0 -to 0 probe5
create_bd_pin -dir I -from 31 -to 0 probe6
create_bd_pin -dir I -from 0 -to 0 probe7
create_bd_pin -dir I -from 279 -to 0 Din1

create_bd_cell -type ip -vlnv xilinx.com:ip:xlslice:1.0 xlslice_2
set_property -dict {CONFIG.DIN_FROM 15 CONFIG.DIN_WIDTH 128 CONFIG.DOUT_WIDTH 16} [get_bd_cells xlslice_2]
create_bd_cell -type ip -vlnv xilinx.com:ip:ila:6.2 ila_0
set_property -dict [list \
  CONFIG.C_DATA_DEPTH 8192 \
  CONFIG.C_ENABLE_ILA_AXI_MON false \
  CONFIG.C_INPUT_PIPE_STAGES 2 \
  CONFIG.C_MONITOR_TYPE Native \
  CONFIG.C_NUM_OF_PROBES 12 \
  CONFIG.C_PROBE0_WIDTH 16 \
  CONFIG.C_PROBE10_WIDTH 35 \
  CONFIG.C_PROBE11_WIDTH 35 \
  CONFIG.C_PROBE1_WIDTH 16 \
  CONFIG.C_PROBE2_WIDTH 16 \
  CONFIG.C_PROBE3_WIDTH 16 \
  CONFIG.C_PROBE6_WIDTH 32 \
  CONFIG.C_PROBE8_WIDTH 35 \
  CONFIG.C_PROBE9_WIDTH 35 \
] [get_bd_cells ila_0]
create_bd_cell -type ip -vlnv xilinx.com:ip:xlslice:1.0 xlslice_3
set_property -dict {CONFIG.DIN_FROM 31 CONFIG.DIN_TO 16 CONFIG.DIN_WIDTH 128 CONFIG.DOUT_WIDTH 16} [get_bd_cells xlslice_3]
create_bd_cell -type ip -vlnv xilinx.com:ip:xlslice:1.0 xlslice_4
set_property -dict {CONFIG.DIN_FROM 47 CONFIG.DIN_TO 32 CONFIG.DIN_WIDTH 128 CONFIG.DOUT_WIDTH 16} [get_bd_cells xlslice_4]
create_bd_cell -type ip -vlnv xilinx.com:ip:xlslice:1.0 xlslice_5
set_property -dict {CONFIG.DIN_FROM 63 CONFIG.DIN_TO 48 CONFIG.DIN_WIDTH 128 CONFIG.DOUT_WIDTH 16} [get_bd_cells xlslice_5]
create_bd_cell -type ip -vlnv xilinx.com:ip:xlslice:1.0 xlslice_7
set_property -dict {CONFIG.DIN_FROM 34 CONFIG.DIN_WIDTH 280 CONFIG.DOUT_WIDTH 35} [get_bd_cells xlslice_7]
create_bd_cell -type ip -vlnv xilinx.com:ip:xlslice:1.0 xlslice_8
set_property -dict {CONFIG.DIN_FROM 69 CONFIG.DIN_TO 35 CONFIG.DIN_WIDTH 280 CONFIG.DOUT_WIDTH 35} [get_bd_cells xlslice_8]
create_bd_cell -type ip -vlnv xilinx.com:ip:xlslice:1.0 xlslice_9
set_property -dict {CONFIG.DIN_FROM 104 CONFIG.DIN_TO 70 CONFIG.DIN_WIDTH 280 CONFIG.DOUT_WIDTH 35} [get_bd_cells xlslice_9]
create_bd_cell -type ip -vlnv xilinx.com:ip:xlslice:1.0 xlslice_6
set_property -dict {CONFIG.DIN_FROM 69 CONFIG.DIN_TO 35 CONFIG.DIN_WIDTH 280 CONFIG.DOUT_WIDTH 35} [get_bd_cells xlslice_6]

# ---- connections ----

current_bd_instance /Gates
connect_bd_intf_net [get_bd_intf_pins AXI4_Lite1] [get_bd_intf_pins Counter_f_sw_V2_ip_0/AXI4_Lite]
connect_bd_intf_net [get_bd_intf_pins S00_AXI] [get_bd_intf_pins uz_interlockDeadtime_0/AXI4]
connect_bd_intf_net [get_bd_intf_pins AXI4_Lite] [get_bd_intf_pins PWM_and_SS_control_V_0/AXI4_Lite]
connect_bd_net [get_bd_pins xlconstant_0/dout] \
  [get_bd_pins PWM_and_SS_control_V_0/m_u1_norm] [get_bd_pins PWM_and_SS_control_V_0/m_u2_norm] \
  [get_bd_pins PWM_and_SS_control_V_0/m_u3_norm]
connect_bd_net -net InterLock_Module_0_S0_OUT [get_bd_pins uz_interlockDeadtime_0/s0_out] \
  [get_bd_pins ila_GateSignal/probe6] [get_bd_pins Counter_f_sw_V2_ip_0/ss_in_0] [get_bd_pins xlconcat_0/In0]
connect_bd_net -net InterLock_Module_0_S1_OUT [get_bd_pins uz_interlockDeadtime_0/s1_out] \
  [get_bd_pins ila_GateSignal/probe7] [get_bd_pins Counter_f_sw_V2_ip_0/ss_in_1] [get_bd_pins xlconcat_0/In1]
connect_bd_net -net InterLock_Module_0_S2_OUT [get_bd_pins uz_interlockDeadtime_0/s2_out] \
  [get_bd_pins ila_GateSignal/probe8] [get_bd_pins Counter_f_sw_V2_ip_0/ss_in_2] [get_bd_pins xlconcat_0/In2]
connect_bd_net -net InterLock_Module_0_S3_OUT [get_bd_pins uz_interlockDeadtime_0/s3_out] \
  [get_bd_pins ila_GateSignal/probe9] [get_bd_pins Counter_f_sw_V2_ip_0/ss_in_3] [get_bd_pins xlconcat_0/In3]
connect_bd_net -net InterLock_Module_0_S4_OUT [get_bd_pins uz_interlockDeadtime_0/s4_out] \
  [get_bd_pins ila_GateSignal/probe10] [get_bd_pins Counter_f_sw_V2_ip_0/ss_in_4] [get_bd_pins xlconcat_0/In4]
connect_bd_net -net InterLock_Module_0_S5_OUT [get_bd_pins uz_interlockDeadtime_0/s5_out] \
  [get_bd_pins ila_GateSignal/probe11] [get_bd_pins Counter_f_sw_V2_ip_0/ss_in_5] [get_bd_pins xlconcat_0/In5]
connect_bd_net -net xlslice_Enable_Inverter_Dout [get_bd_pins Enable_Gate] [get_bd_pins ila_GateSignal/probe12]
connect_bd_net -net zynq_ultra_ps_e_0_pl_clk1 [get_bd_pins AXI4_Lite_ACLK] \
  [get_bd_pins PWM_and_SS_control_V_0/IPCORE_CLK] [get_bd_pins PWM_and_SS_control_V_0/AXI4_Lite_ACLK] \
  [get_bd_pins ila_GateSignal/clk] [get_bd_pins Counter_f_sw_V2_ip_0/AXI4_Lite_ACLK] \
  [get_bd_pins Counter_f_sw_V2_ip_0/IPCORE_CLK] [get_bd_pins vio_Gates_2L/clk] \
  [get_bd_pins uz_interlockDeadtime_0/IPCORE_CLK] [get_bd_pins uz_interlockDeadtime_0/AXI4_ACLK]
connect_bd_net -net FCS_SPMSM_Np1_i_V46_ip_0_ss_0 [get_bd_pins vio_Gates_2L/probe_out0] \
  [get_bd_pins PWM_and_SS_control_V_0/SS0_IN_External] [get_bd_pins ila_GateSignal/probe0]
connect_bd_net -net FCS_SPMSM_Np1_i_V46_ip_0_ss_1 [get_bd_pins vio_Gates_2L/probe_out1] \
  [get_bd_pins PWM_and_SS_control_V_0/SS1_IN_External] [get_bd_pins ila_GateSignal/probe1]
connect_bd_net -net FCS_SPMSM_Np1_i_V46_ip_0_ss_2 [get_bd_pins vio_Gates_2L/probe_out2] \
  [get_bd_pins PWM_and_SS_control_V_0/SS2_IN_External] [get_bd_pins ila_GateSignal/probe2]
connect_bd_net -net FCS_SPMSM_Np1_i_V46_ip_0_ss_3 [get_bd_pins vio_Gates_2L/probe_out3] \
  [get_bd_pins PWM_and_SS_control_V_0/SS3_IN_External] [get_bd_pins ila_GateSignal/probe3]
connect_bd_net -net FCS_SPMSM_Np1_i_V46_ip_0_ss_4 [get_bd_pins vio_Gates_2L/probe_out4] \
  [get_bd_pins PWM_and_SS_control_V_0/SS4_IN_External] [get_bd_pins ila_GateSignal/probe4]
connect_bd_net -net FCS_SPMSM_Np1_i_V46_ip_0_ss_5 [get_bd_pins vio_Gates_2L/probe_out5] \
  [get_bd_pins PWM_and_SS_control_V_0/SS5_IN_External] [get_bd_pins ila_GateSignal/probe5]
connect_bd_net [get_bd_pins PWM_and_SS_control_V_0/SS0_OUT] [get_bd_pins ila_GateSignal/probe14] [get_bd_pins uz_interlockDeadtime_0/S0]
connect_bd_net [get_bd_pins PWM_and_SS_control_V_0/SS1_OUT] [get_bd_pins ila_GateSignal/probe15] [get_bd_pins uz_interlockDeadtime_0/S1]
connect_bd_net [get_bd_pins PWM_and_SS_control_V_0/SS2_OUT] [get_bd_pins ila_GateSignal/probe16] [get_bd_pins uz_interlockDeadtime_0/S2]
connect_bd_net [get_bd_pins PWM_and_SS_control_V_0/SS3_OUT] [get_bd_pins ila_GateSignal/probe17] [get_bd_pins uz_interlockDeadtime_0/S3]
connect_bd_net [get_bd_pins PWM_and_SS_control_V_0/SS4_OUT] [get_bd_pins ila_GateSignal/probe18] [get_bd_pins uz_interlockDeadtime_0/S4]
connect_bd_net [get_bd_pins PWM_and_SS_control_V_0/SS5_OUT] [get_bd_pins ila_GateSignal/probe19] [get_bd_pins uz_interlockDeadtime_0/S5]
connect_bd_net [get_bd_pins PWM_and_SS_control_V_0/PWM_enb_out] [get_bd_pins ila_GateSignal/probe20]
connect_bd_net [get_bd_pins PWM_and_SS_control_V_0/Triangular_Max] \
  [get_bd_pins util_vector_logic_0/Op1] [get_bd_pins Carrier_triangular_max] [get_bd_pins ila_GateSignal/probe21]
connect_bd_net [get_bd_pins PWM_and_SS_control_V_0/Triangular_Min] \
  [get_bd_pins util_vector_logic_0/Op2] [get_bd_pins Carrier_triangular_min] [get_bd_pins ila_GateSignal/probe22]
connect_bd_net [get_bd_pins AXI4_Lite_ARESETN] \
  [get_bd_pins PWM_and_SS_control_V_0/IPCORE_RESETN] [get_bd_pins PWM_and_SS_control_V_0/AXI4_Lite_ARESETN] \
  [get_bd_pins Counter_f_sw_V2_ip_0/AXI4_Lite_ARESETN] [get_bd_pins Counter_f_sw_V2_ip_0/IPCORE_RESETN] \
  [get_bd_pins uz_interlockDeadtime_0/AXI4_ARESETN] [get_bd_pins uz_interlockDeadtime_0/IPCORE_RESETN]
connect_bd_net [get_bd_pins xlconcat_0/dout] [get_bd_pins Gate_Signals_2L]
connect_bd_net [get_bd_pins Counter_f_sw_V2_ip_0/switchNumb] [get_bd_pins ila_GateSignal/probe23]
connect_bd_net [get_bd_pins util_vector_logic_0/Res] [get_bd_pins Carrier_triangular_max_min] [get_bd_pins ila_GateSignal/probe13]

current_bd_instance /DataMover
connect_bd_intf_net [get_bd_intf_pins M00_AXI] [get_bd_intf_pins AXI2TCM_0/M00_AXI]
connect_bd_net -net init_axi2tcm [get_bd_pins util_vector_logic_0/Res] [get_bd_pins AXI2TCM_0/init_axi_txn] [get_bd_pins ila_0/probe1]
connect_bd_net -net ADCs_ADC_values_raw [get_bd_pins xlconcat_0/dout] [get_bd_pins AXI2TCM_0/DATA_IN] [get_bd_pins ila_0/probe0]
connect_bd_net -net zynq_ultra_ps_e_0_pl_clk1 [get_bd_pins m00_axi_aclk] [get_bd_pins AXI2TCM_0/m00_axi_aclk] [get_bd_pins ila_0/clk]
connect_bd_net -net proc_sys_reset_1_peripheral_aresetn [get_bd_pins m00_axi_aresetn] [get_bd_pins AXI2TCM_0/m00_axi_aresetn]
connect_bd_net -net DATA_IN1_1 [get_bd_pins Trigger_AXI2TCM] [get_bd_pins util_vector_logic_0/Op1] [get_bd_pins ila_0/probe4]
connect_bd_net -net DATA_IN2_1 [get_bd_pins Enable_AXI2TCM] [get_bd_pins util_vector_logic_0/Op2]
connect_bd_net [get_bd_pins AXI2TCM_0/write_done] [get_bd_pins ila_0/probe2]
connect_bd_net [get_bd_pins AXI2TCM_0/axi_error] [get_bd_pins ila_0/probe3]
connect_bd_net -net ADC_A1_1 [get_bd_pins ADC_A1] [get_bd_pins xlconcat_0/In0]
connect_bd_net -net ADC_A2_1 [get_bd_pins ADC_A2] [get_bd_pins xlconcat_0/In1]
connect_bd_net -net ADC_A3_1 [get_bd_pins ADC_A3] [get_bd_pins xlconcat_0/In2]

current_bd_instance /Gates_3L
connect_bd_intf_net -intf_net smartconnect_0_M12_AXI [get_bd_intf_pins AXI4_Lite] [get_bd_intf_pins PWM_SS_3L_ip_0/AXI4_Lite]
connect_bd_net -net zynq_ultra_ps_e_0_pl_clk1 [get_bd_pins AXI4_Lite_ACLK] \
  [get_bd_pins PWM_SS_3L_ip_0/AXI4_Lite_ACLK] [get_bd_pins PWM_SS_3L_ip_0/IPCORE_CLK] \
  [get_bd_pins top_npc_state_machine_0/clock] [get_bd_pins ila_0/clk] [get_bd_pins Set_Deadtime_3L/clk] \
  [get_bd_pins vio_Gates_3L/clk]
connect_bd_net -net proc_sys_reset_1_peripheral_aresetn [get_bd_pins AXI4_Lite_ARESETN] \
  [get_bd_pins PWM_SS_3L_ip_0/AXI4_Lite_ARESETN] [get_bd_pins PWM_SS_3L_ip_0/IPCORE_RESETN]
connect_bd_net [get_bd_pins PWM_SS_3L_ip_0/SSa1_OUT] [get_bd_pins Gates_Vector/In0] [get_bd_pins ila_0/probe14]
connect_bd_net [get_bd_pins PWM_SS_3L_ip_0/SSa2_OUT] [get_bd_pins Gates_Vector/In1] [get_bd_pins ila_0/probe15]
connect_bd_net [get_bd_pins PWM_SS_3L_ip_0/SSb1_OUT] [get_bd_pins Gates_Vector/In2] [get_bd_pins ila_0/probe16]
connect_bd_net [get_bd_pins PWM_SS_3L_ip_0/SSb2_OUT] [get_bd_pins Gates_Vector/In3] [get_bd_pins ila_0/probe17]
connect_bd_net [get_bd_pins PWM_SS_3L_ip_0/SSc1_OUT] [get_bd_pins Gates_Vector/In4] [get_bd_pins ila_0/probe18]
connect_bd_net [get_bd_pins PWM_SS_3L_ip_0/SSc2_OUT] [get_bd_pins Gates_Vector/In5] [get_bd_pins ila_0/probe19]
connect_bd_net [get_bd_pins Gates_Vector/dout] [get_bd_pins top_npc_state_machine_0/switching_signals] [get_bd_pins ila_0/probe13]
connect_bd_net [get_bd_pins top_npc_state_machine_0/A_S1] [get_bd_pins xlconcat_0/In0] [get_bd_pins ila_0/probe0]
connect_bd_net [get_bd_pins top_npc_state_machine_0/A_S2] [get_bd_pins xlconcat_0/In1] [get_bd_pins ila_0/probe1]
connect_bd_net [get_bd_pins top_npc_state_machine_0/A_S3] [get_bd_pins xlconcat_0/In2] [get_bd_pins ila_0/probe2]
connect_bd_net [get_bd_pins top_npc_state_machine_0/A_S4] [get_bd_pins xlconcat_0/In3] [get_bd_pins ila_0/probe3]
connect_bd_net [get_bd_pins top_npc_state_machine_0/B_S1] [get_bd_pins xlconcat_0/In4] [get_bd_pins ila_0/probe4]
connect_bd_net [get_bd_pins top_npc_state_machine_0/B_S2] [get_bd_pins xlconcat_0/In5] [get_bd_pins ila_0/probe5]
connect_bd_net [get_bd_pins top_npc_state_machine_0/B_S3] [get_bd_pins xlconcat_0/In6] [get_bd_pins ila_0/probe6]
connect_bd_net [get_bd_pins top_npc_state_machine_0/B_S4] [get_bd_pins xlconcat_0/In7] [get_bd_pins ila_0/probe7]
connect_bd_net [get_bd_pins top_npc_state_machine_0/C_S1] [get_bd_pins xlconcat_0/In8] [get_bd_pins ila_0/probe8]
connect_bd_net [get_bd_pins top_npc_state_machine_0/C_S2] [get_bd_pins xlconcat_0/In9] [get_bd_pins ila_0/probe9]
connect_bd_net [get_bd_pins top_npc_state_machine_0/C_S3] [get_bd_pins xlconcat_0/In10] [get_bd_pins ila_0/probe10]
connect_bd_net [get_bd_pins top_npc_state_machine_0/C_S4] [get_bd_pins xlconcat_0/In11] [get_bd_pins ila_0/probe11]
connect_bd_net [get_bd_pins xlconcat_0/dout] [get_bd_pins Gate_Signals_3L]
connect_bd_net [get_bd_pins PWM_SS_3L_ip_0/Period_Center] \
  [get_bd_pins ila_0/probe20] [get_bd_pins Interrupt_Center] [get_bd_pins Interrupt_Start_Center/Op1]
connect_bd_net [get_bd_pins PWM_SS_3L_ip_0/Period_Start] \
  [get_bd_pins ila_0/probe21] [get_bd_pins Interrupt_Start] [get_bd_pins Interrupt_Start_Center/Op2]
connect_bd_net [get_bd_pins Enable_Gates] [get_bd_pins top_npc_state_machine_0/enable]
connect_bd_net [get_bd_pins Interrupt_Start_Center/Res] [get_bd_pins ila_0/probe12] [get_bd_pins Interrupt_Start_Center]
connect_bd_net [get_bd_pins Set_Deadtime_3L/probe_out0] [get_bd_pins top_npc_state_machine_0/deadtime] [get_bd_pins ila_0/probe22]
connect_bd_net [get_bd_pins vio_Gates_3L/probe_out0] [get_bd_pins PWM_SS_3L_ip_0/m_u1_norm]
connect_bd_net [get_bd_pins vio_Gates_3L/probe_out1] [get_bd_pins PWM_SS_3L_ip_0/m_u2_norm]
connect_bd_net [get_bd_pins vio_Gates_3L/probe_out2] [get_bd_pins PWM_SS_3L_ip_0/m_u3_norm]
connect_bd_net [get_bd_pins vio_Gates_3L/probe_out3] [get_bd_pins PWM_SS_3L_ip_0/SSa1_IN_External]
connect_bd_net [get_bd_pins vio_Gates_3L/probe_out4] [get_bd_pins PWM_SS_3L_ip_0/SSa2_IN_External]
connect_bd_net [get_bd_pins vio_Gates_3L/probe_out5] [get_bd_pins PWM_SS_3L_ip_0/SSb1_IN_External]
connect_bd_net [get_bd_pins vio_Gates_3L/probe_out6] [get_bd_pins PWM_SS_3L_ip_0/SSb2_IN_External]
connect_bd_net [get_bd_pins vio_Gates_3L/probe_out7] [get_bd_pins PWM_SS_3L_ip_0/SSc1_IN_External]
connect_bd_net [get_bd_pins vio_Gates_3L/probe_out8] [get_bd_pins PWM_SS_3L_ip_0/SSc2_IN_External]

current_bd_instance /Interrupt
connect_bd_intf_net [get_bd_intf_pins AXI4_Lite] [get_bd_intf_pins mux_axi_ip_1/AXI4_Lite]
connect_bd_intf_net -intf_net smartconnect_0_M11_AXI [get_bd_intf_pins S_AXI] [get_bd_intf_pins Trigger_f_cc/S_AXI]
connect_bd_net [get_bd_pins Trigger_f_cc/interrupt] [get_bd_pins Concat_interrupts/In6] [get_bd_pins ila_0/probe6]
connect_bd_net -net Gates_Carrier_triangular_max_min [get_bd_pins Interrupt0] [get_bd_pins ila_0/probe0] [get_bd_pins Concat_interrupts/In0]
connect_bd_net -net Gates_Carrier_triangular_min1 [get_bd_pins Interrupt1] [get_bd_pins ila_0/probe1] [get_bd_pins Concat_interrupts/In1]
connect_bd_net -net Gates_Carrier_triangular_max1 [get_bd_pins Interrupt2] [get_bd_pins ila_0/probe2] [get_bd_pins Concat_interrupts/In2]
connect_bd_net -net Gates_3L_Interrupt_Start_Center [get_bd_pins Interrupt3] [get_bd_pins ila_0/probe3] [get_bd_pins Concat_interrupts/In3]
connect_bd_net -net Gates_3L_Interrupt_Start [get_bd_pins Interrupt4] [get_bd_pins ila_0/probe4] [get_bd_pins Concat_interrupts/In4]
connect_bd_net -net Gates_3L_Interrupt_Center [get_bd_pins Interrupt5] [get_bd_pins ila_0/probe5] [get_bd_pins Concat_interrupts/In5]
connect_bd_net -net zynq_ultra_ps_e_0_pl_clk1 [get_bd_pins clk] \
  [get_bd_pins ila_0/clk] [get_bd_pins Trigger_f_cc/s_axi_aclk] [get_bd_pins delay_trigger_0/clk] [get_bd_pins adc_delay/clk] \
  [get_bd_pins vio_interrupt/clk] [get_bd_pins mux_axi_ip_1/IPCORE_CLK] [get_bd_pins mux_axi_ip_1/AXI4_Lite_ACLK]
connect_bd_net -net proc_sys_reset_1_peripheral_aresetn [get_bd_pins IPCORE_RESETN] \
  [get_bd_pins Trigger_f_cc/s_axi_aresetn] [get_bd_pins mux_axi_ip_1/IPCORE_RESETN] \
  [get_bd_pins mux_axi_ip_1/AXI4_Lite_ARESETN]
connect_bd_net [get_bd_pins delay_trigger_0/a_out] [get_bd_pins trigger_converesions] [get_bd_pins ila_0/probe9]
connect_bd_net [get_bd_pins adc_delay/probe_out0] [get_bd_pins delay_trigger_0/delay_cycles]
connect_bd_net -net vio_0_probe_out0 [get_bd_pins vio_interrupt/probe_out0] [get_bd_pins Concat_interrupts/In7]
connect_bd_net [get_bd_pins mux_axi_ip_1/interrupt_out_adc] [get_bd_pins delay_trigger_0/a_in] [get_bd_pins ila_0/probe7]
connect_bd_net [get_bd_pins mux_axi_ip_1/select_out] [get_bd_pins ila_0/probe8]
connect_bd_net [get_bd_pins Concat_interrupts/dout] [get_bd_pins mux_axi_ip_1/interrupts_in]
connect_bd_net [get_bd_pins mux_axi_ip_1/interrupt_out_isr] [get_bd_pins Interrupt_vector]

current_bd_instance /adc_debug
connect_bd_net [get_bd_pins xlslice_2/Dout] [get_bd_pins ila_0/probe0]
connect_bd_net [get_bd_pins xlslice_3/Dout] [get_bd_pins ila_0/probe1]
connect_bd_net [get_bd_pins xlslice_4/Dout] [get_bd_pins ila_0/probe2]
connect_bd_net [get_bd_pins xlslice_5/Dout] [get_bd_pins ila_0/probe3]
connect_bd_net [get_bd_pins xlslice_7/Dout] [get_bd_pins ila_0/probe8]
connect_bd_net [get_bd_pins xlslice_6/Dout] [get_bd_pins ila_0/probe9]
connect_bd_net [get_bd_pins xlslice_8/Dout] [get_bd_pins ila_0/probe10]
connect_bd_net [get_bd_pins xlslice_9/Dout] [get_bd_pins ila_0/probe11]
connect_bd_net -net ADC_LTC2311_1_RAW_VALUE [get_bd_pins Din] \
  [get_bd_pins xlslice_3/Din] [get_bd_pins xlslice_4/Din] [get_bd_pins xlslice_5/Din] [get_bd_pins xlslice_2/Din]
connect_bd_net -net zynq_ultra_ps_e_0_pl_clk1 [get_bd_pins clk] [get_bd_pins ila_0/clk]
connect_bd_net -net Current_Valid_0_Dout [get_bd_pins probe4] [get_bd_pins ila_0/probe4]
connect_bd_net -net Interrupt_muxed [get_bd_pins probe5] [get_bd_pins ila_0/probe5]
connect_bd_net -net A1_ADC_LTC2311_SAMPLE_COUNTER [get_bd_pins probe6] [get_bd_pins ila_0/probe6]
connect_bd_net -net A1_ADC_LTC2311_SI_VALID [get_bd_pins probe7] [get_bd_pins ila_0/probe7]
connect_bd_net -net A1_ADC_LTC2311_SI_VALUE [get_bd_pins Din1] \
  [get_bd_pins xlslice_6/Din] [get_bd_pins xlslice_8/Din] [get_bd_pins xlslice_9/Din] [get_bd_pins xlslice_7/Din]

current_bd_instance /
connect_bd_intf_net [get_bd_intf_pins A2_ADC_LTC2311/S00_AXI] [get_bd_intf_pins smartconnect_0/M01_AXI]
connect_bd_intf_net [get_bd_intf_pins smartconnect_1/S00_AXI] [get_bd_intf_pins smartconnect_0/M10_AXI]
connect_bd_intf_net -intf_net AXI2TCM_0_M00_AXI [get_bd_intf_pins zynq_ultra_ps_e_0/S_AXI_LPD] [get_bd_intf_pins DataMover/M00_AXI]
connect_bd_intf_net [get_bd_intf_pins smartconnect_1/M00_AXI] [get_bd_intf_pins uz_axi_testIP_0/AXI4]
connect_bd_intf_net [get_bd_intf_pins smartconnect_0/M09_AXI] [get_bd_intf_pins IncreEncoder_V24_ip_0/AXI4_Lite]
connect_bd_intf_net [get_bd_intf_pins smartconnect_0/M06_AXI] [get_bd_intf_pins axi_gpio_2/S_AXI]
connect_bd_intf_net [get_bd_intf_pins smartconnect_0/M07_AXI] [get_bd_intf_pins Gates/S00_AXI]
connect_bd_intf_net [get_bd_intf_pins Interrupt/AXI4_Lite] [get_bd_intf_pins smartconnect_0/M04_AXI]
connect_bd_intf_net [get_bd_intf_pins smartconnect_0/M08_AXI] [get_bd_intf_pins Gates/AXI4_Lite]
connect_bd_intf_net [get_bd_intf_pins smartconnect_0/M11_AXI] [get_bd_intf_pins Interrupt/S_AXI]
connect_bd_intf_net [get_bd_intf_pins smartconnect_0/M12_AXI] [get_bd_intf_pins Gates_3L/AXI4_Lite]
connect_bd_intf_net [get_bd_intf_pins smartconnect_0/M13_AXI] [get_bd_intf_pins Resolver_Interface_v_0/s00_axi]
connect_bd_intf_net [get_bd_intf_pins A1_ADC_LTC2311/S00_AXI] [get_bd_intf_pins smartconnect_0/M00_AXI]
connect_bd_intf_net [get_bd_intf_pins smartconnect_0/S00_AXI] [get_bd_intf_pins zynq_ultra_ps_e_0/M_AXI_HPM0_LPD]
connect_bd_intf_net [get_bd_intf_pins timer_uptime_64bit/S_AXI] [get_bd_intf_pins smartconnect_0/M05_AXI]
connect_bd_intf_net -intf_net AXI4_Lite1_1 [get_bd_intf_pins Gates/AXI4_Lite1] [get_bd_intf_pins smartconnect_0/M03_AXI]
connect_bd_intf_net [get_bd_intf_pins A3_ADC_LTC2311/S00_AXI] [get_bd_intf_pins smartconnect_0/M02_AXI]
connect_bd_net -net proc_sys_reset_1_peripheral_aresetn [get_bd_pins proc_sys_reset_100MHz/peripheral_aresetn] \
  [get_bd_pins Gates/AXI4_Lite_ARESETN] [get_bd_pins DataMover/m00_axi_aresetn] [get_bd_pins axi_gpio_2/s_axi_aresetn] \
  [get_bd_pins smartconnect_0/aresetn] [get_bd_pins Gates_3L/AXI4_Lite_ARESETN] [get_bd_pins Interrupt/IPCORE_RESETN] \
  [get_bd_pins timer_uptime_64bit/s_axi_aresetn] [get_bd_pins uz_axi_testIP_0/IPCORE_RESETN] \
  [get_bd_pins uz_axi_testIP_0/AXI4_ARESETN] [get_bd_pins A1_ADC_LTC2311/s00_axi_aresetn] \
  [get_bd_pins A2_ADC_LTC2311/s00_axi_aresetn] [get_bd_pins A3_ADC_LTC2311/s00_axi_aresetn] \
  [get_bd_pins smartconnect_1/aresetn] [get_bd_pins Resolver_Interface_v_0/s00_axi_aresetn]
connect_bd_net [get_bd_pins zynq_ultra_ps_e_0/pl_resetn0] \
  [get_bd_pins proc_sys_reset_25MHz/ext_reset_in] [get_bd_pins proc_sys_reset_10MHz/ext_reset_in] \
  [get_bd_pins proc_sys_reset_50MHz/ext_reset_in] [get_bd_pins proc_sys_reset_100MHz/ext_reset_in] \
  [get_bd_pins clk_wiz_0/resetn]
connect_bd_net -net zynq_ultra_ps_e_0_pl_clk3 [get_bd_pins clk_wiz_0/clk_50MHz] \
  [get_bd_pins proc_sys_reset_50MHz/slowest_sync_clk] [get_bd_pins smartconnect_0/aclk2] \
  [get_bd_pins IncreEncoder_V24_ip_0/IPCORE_CLK] [get_bd_pins IncreEncoder_V24_ip_0/AXI4_Lite_ACLK]
connect_bd_net -net zynq_ultra_ps_e_0_pl_clk2 [get_bd_pins clk_wiz_0/clk_10MHz] \
  [get_bd_pins proc_sys_reset_10MHz/slowest_sync_clk] [get_bd_pins Gates/s00_axi_aclk] [get_bd_pins smartconnect_0/aclk1]
connect_bd_net [get_bd_pins axi_gpio_2/gpio_io_o] \
  [get_bd_pins xlslice_Enable_Inverter_Bit0/Din] [get_bd_pins xlslice_Enable_Gate_Bit1/Din] \
  [get_bd_pins xlslice_Enable_AXI2TCM_Bit4/Din]
connect_bd_net -net xlslice_Enable_Gate_Dout [get_bd_pins xlslice_Enable_Gate_Bit1/Dout] \
  [get_bd_ports D1_OUT_30] [get_bd_ports D2_OUT_30] [get_bd_ports D3_OUT_30]
connect_bd_net -net xlslice_Enable_Inverter_Dout [get_bd_pins xlslice_Enable_Inverter_Bit0/Dout] \
  [get_bd_pins Gates/Enable_Gate] [get_bd_pins Gates_3L/Enable_Gates]
connect_bd_net -net Interrupt_muxed [get_bd_pins Interrupt/trigger_converesions] \
  [get_bd_pins IncreEncoder_V24_ip_0/PeriodEnd] [get_bd_pins ila_Encoder/probe5] [get_bd_pins A2_ADC_LTC2311/TRIGGER_CNV] \
  [get_bd_pins A3_ADC_LTC2311/TRIGGER_CNV] [get_bd_pins A1_ADC_LTC2311/TRIGGER_CNV] [get_bd_pins adc_debug/probe5] \
  [get_bd_pins Resolver_Interface_v_0/sample_trigger]
connect_bd_net [get_bd_pins proc_sys_reset_50MHz/peripheral_aresetn] \
  [get_bd_pins IncreEncoder_V24_ip_0/IPCORE_RESETN] [get_bd_pins IncreEncoder_V24_ip_0/AXI4_Lite_ARESETN]
connect_bd_net -net xlconcat_0_dout [get_bd_pins Interrupt/Interrupt_vector] [get_bd_pins zynq_ultra_ps_e_0/pl_ps_irq0]
connect_bd_net [get_bd_pins proc_sys_reset_10MHz/peripheral_aresetn] [get_bd_pins Gates/s00_axi_aresetn]
connect_bd_net [get_bd_pins clk_wiz_0/clk_25MHz] [get_bd_pins proc_sys_reset_25MHz/slowest_sync_clk]
connect_bd_net -net IncreEncoder_ip_0_theta_el [get_bd_pins IncreEncoder_V24_ip_0/theta_el] [get_bd_pins ila_Encoder/probe4]
connect_bd_net -net Current_Valid_0_Dout [get_bd_pins A1_ADC_LTC2311/RAW_VALID] [get_bd_pins DataMover/Trigger_AXI2TCM] [get_bd_pins adc_debug/probe4]
connect_bd_net [get_bd_pins Enable_Gates_CPLD_Low/dout] \
  [get_bd_ports D1_OUT_27] [get_bd_ports D1_OUT_28] [get_bd_ports D2_OUT_28] [get_bd_ports D2_OUT_27] [get_bd_ports D3_OUT_28] \
  [get_bd_ports D3_OUT_27]
connect_bd_net [get_bd_pins Enable_Gates_CPLD_High/dout] [get_bd_ports D1_OUT_29] [get_bd_ports D2_OUT_29] [get_bd_ports D3_OUT_29]
connect_bd_net [get_bd_pins xlslice_Enable_AXI2TCM_Bit4/Dout] [get_bd_pins DataMover/Enable_AXI2TCM]
connect_bd_net -net vio_D2_test_probe_out0 [get_bd_pins vio_D34_test/probe_out0] [get_bd_ports D3_OUT]
connect_bd_net [get_bd_ports A2_IN] [get_bd_pins A2_ADC_LTC2311/MISO_DIFF]
connect_bd_net [get_bd_pins Gates_3L/Gate_Signals_3L] [get_bd_ports D2_OUT]
connect_bd_net [get_bd_pins IncreEncoder_V24_ip_0/omega] [get_bd_pins ila_Encoder/probe3]
connect_bd_net [get_bd_pins IncreEncoder_V24_ip_0/position] [get_bd_pins ila_Encoder/probe6]
connect_bd_net [get_bd_pins IncreEncoder_V24_ip_0/OverSamplFactor] [get_bd_pins ila_Encoder/probe7]
connect_bd_net -net Gates_dout_0 [get_bd_pins Gates/Gate_Signals_2L] [get_bd_ports D1_OUT]
connect_bd_net [get_bd_pins Gates/Carrier_triangular_max_min] [get_bd_pins Interrupt/Interrupt0]
connect_bd_net [get_bd_pins Gates/Carrier_triangular_min] [get_bd_pins Interrupt/Interrupt1]
connect_bd_net [get_bd_pins Gates/Carrier_triangular_max] [get_bd_pins Interrupt/Interrupt2]
connect_bd_net [get_bd_pins Gates_3L/Interrupt_Start_Center] [get_bd_pins Interrupt/Interrupt3]
connect_bd_net [get_bd_pins Gates_3L/Interrupt_Start] [get_bd_pins Interrupt/Interrupt4]
connect_bd_net [get_bd_pins Gates_3L/Interrupt_Center] [get_bd_pins Interrupt/Interrupt5]
connect_bd_net [get_bd_pins zynq_ultra_ps_e_0/pl_clk0] \
  [get_bd_pins proc_sys_reset_100MHz/slowest_sync_clk] [get_bd_pins Gates/AXI4_Lite_ACLK] \
  [get_bd_pins DataMover/m00_axi_aclk] [get_bd_pins vio_D34_test/clk] [get_bd_pins axi_gpio_2/s_axi_aclk] \
  [get_bd_pins clk_wiz_0/clk_in1] [get_bd_pins ila_Encoder/clk] [get_bd_pins smartconnect_0/aclk] \
  [get_bd_pins zynq_ultra_ps_e_0/maxihpm0_lpd_aclk] [get_bd_pins zynq_ultra_ps_e_0/saxi_lpd_aclk] \
  [get_bd_pins Gates_3L/AXI4_Lite_ACLK] [get_bd_pins Interrupt/clk] [get_bd_pins timer_uptime_64bit/s_axi_aclk] \
  [get_bd_pins uz_axi_testIP_0/IPCORE_CLK] [get_bd_pins uz_axi_testIP_0/AXI4_ACLK] [get_bd_pins adc_debug/clk] \
  [get_bd_pins A1_ADC_LTC2311/s00_axi_aclk] [get_bd_pins A2_ADC_LTC2311/s00_axi_aclk] \
  [get_bd_pins A3_ADC_LTC2311/s00_axi_aclk] [get_bd_pins smartconnect_1/aclk] \
  [get_bd_pins Resolver_Interface_v_0/s00_axi_aclk]
connect_bd_net -net ADC_LTC2311_1_RAW_VALUE [get_bd_pins A1_ADC_LTC2311/RAW_VALUE] [get_bd_pins DataMover/ADC_A1] [get_bd_pins adc_debug/Din]
connect_bd_net -net ADC_LTC2311_1_SS_N [get_bd_pins A1_ADC_LTC2311/SS_N] [get_bd_ports A1_OUT_CNV_1] [get_bd_ports A1_OUT_CNV_0]
connect_bd_net [get_bd_ports A1_IN] [get_bd_pins A1_ADC_LTC2311/MISO_DIFF]
connect_bd_net -net ADC_LTC2311_0_RAW_VALUE [get_bd_pins A2_ADC_LTC2311/RAW_VALUE] [get_bd_pins DataMover/ADC_A2]
connect_bd_net -net ADC_LTC2311_0_SCLK_DIFF [get_bd_pins A2_ADC_LTC2311/SCLK_DIFF] [get_bd_ports A2_OUT_CLK]
connect_bd_net -net ADC_LTC2311_0_SS_N [get_bd_pins A2_ADC_LTC2311/SS_N] [get_bd_ports A2_OUT_CNV_0] [get_bd_ports A2_OUT_CNV_1]
